# EAGLE schematic highpass filter (EAGLE 5.00)
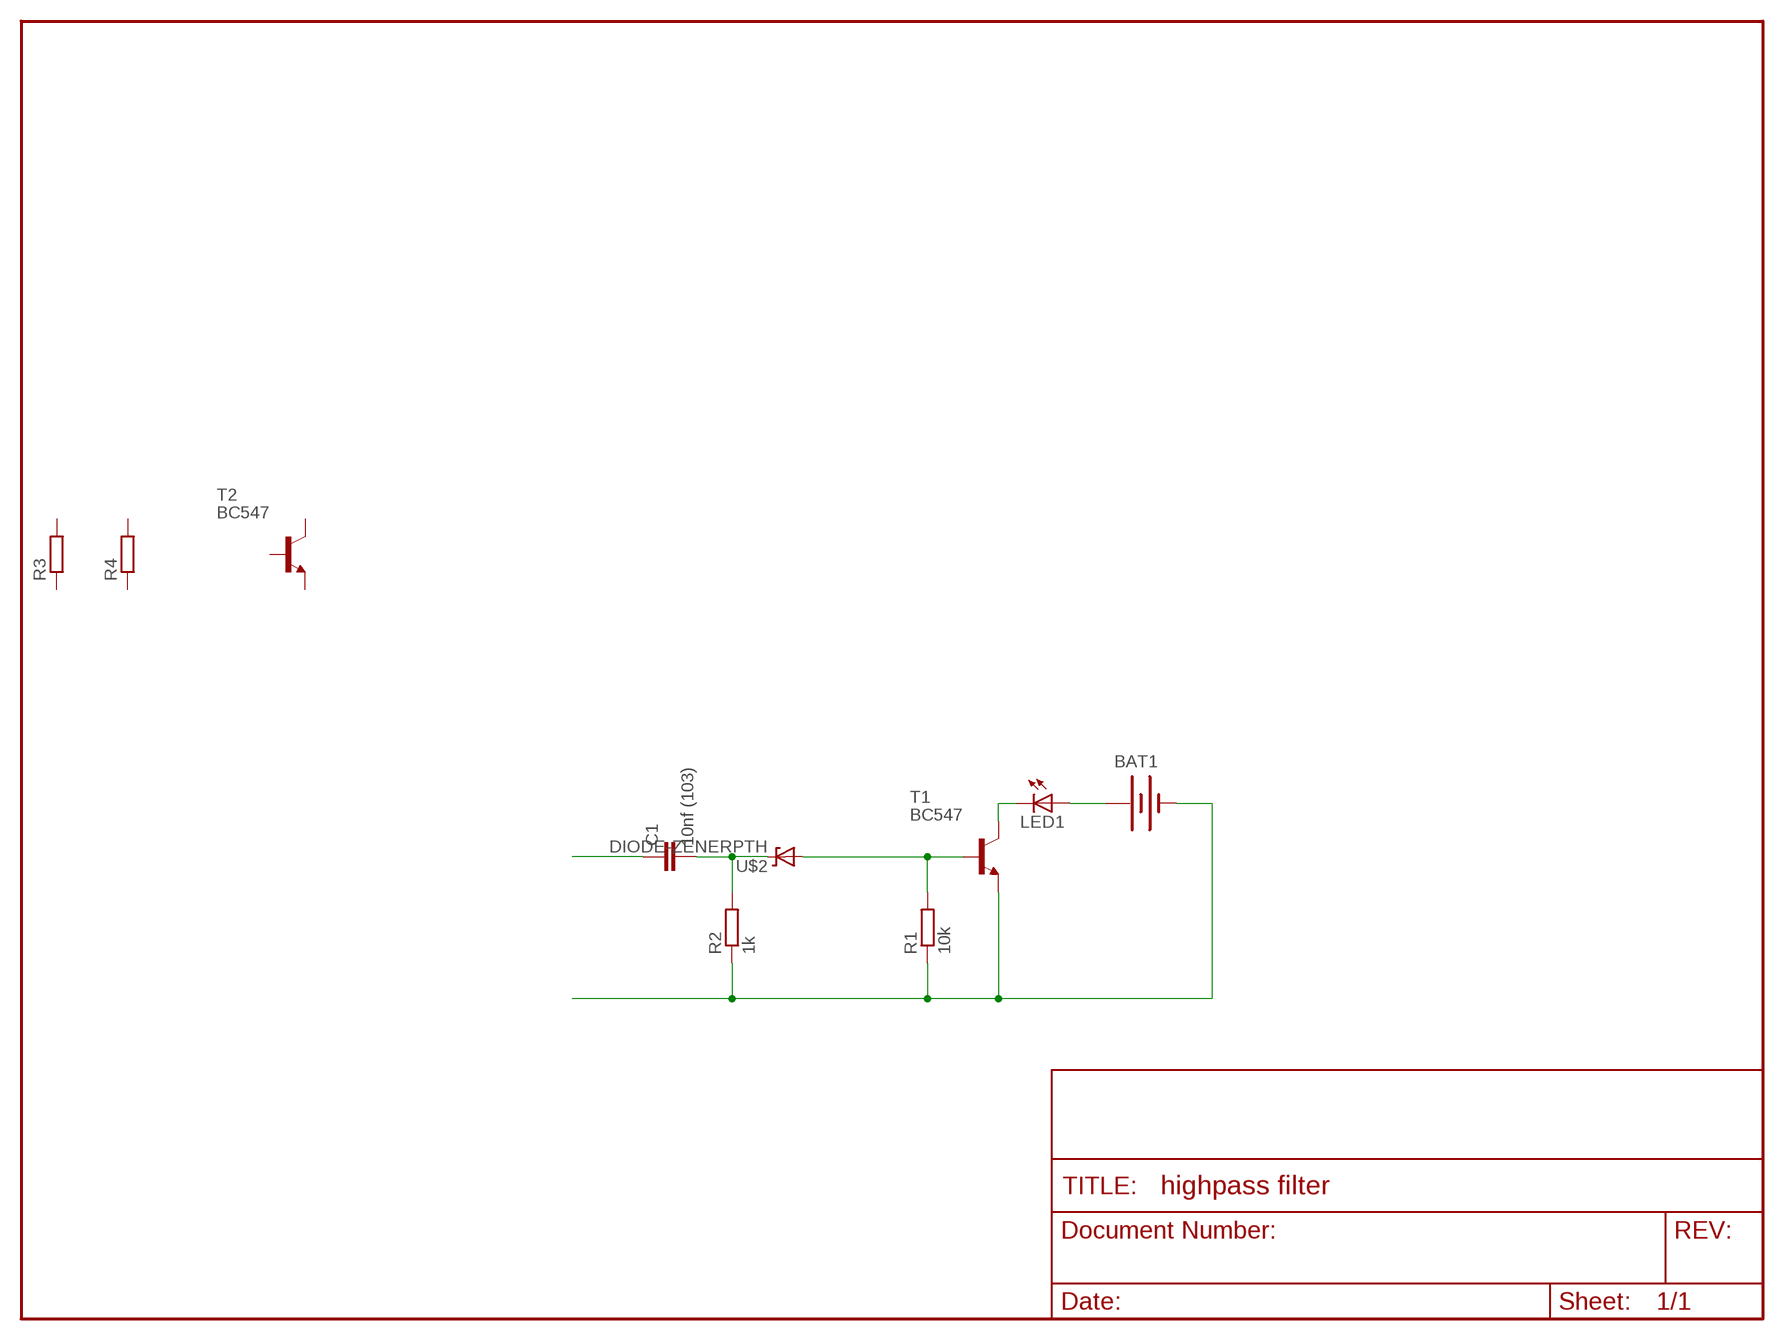
[diagram p0: schematic, sheet 1]

## Parts
BAT1  BATTERY20PTH  [BATTCOM_20MM_PTH]
C1  10nf (103)  C-EU050-030X075  [C050-030X075]
LED1  LED5MM  [LED5MM]
R1  10k  R-EU_0204/7  [0204/7]
R2  1k  R-EU_0204/7  [0204/7]
R3  R-EU_0204/7  [0204/7]
R4  R-EU_0204/7  [0204/7]
T1  BC547  [TO92]
T2  BC547  [TO92]
U$2  DIODE-ZENERPTH  [DIODE-ZENER]

## Nets
N$1: C1.1
N$2: R1.2 T1.2(B) U$2.P$2(A)
N$4: BAT1.2(-) R1.1 R2.1 T1.1(E)
N$6: C1.2 R2.2 U$2.P$1(C)
N$8: LED1.K(C) T1.3(C)
N$11: BAT1.1(+) LED1.A
Unconnected: R3.1 R3.2 R4.1 R4.2 T2.1(E) T2.2(B) T2.3(C)

## Library data of the parts
BAT1 = SparkFun:BATTERY: Battery Holders Various common sizes : AA, AAA, 20mm coin cell and 12mm coin cell.
C1 = resistor:C-EU: CAPACITOR, European symbol
LED1 = SparkFun:LED: LEDs Standard schematic elements and footprints for 5mm, 3mm, 1206, and 0603 sized LEDs. 5mm - Spark Fun Electronics SKU : COM-00529 (and others)
R1-R4 = rcl:R-EU_: RESISTOR, European symbol
T1 T2 = transistor:BC547: NPN TRANSISTOR
U$2 = SparkFun:DIODE-ZENER: Zener Diode Production Part - 8199 3.4V Zener Voltage